# EasyEDA Pro project 9键自定义键盘.epro

# Schematic Schematic1

## Sheets
1 核心板: Board Name: Board1; Create Date: 2026-05-17; Page Name: 核心板; Project Name: 16键自定义键盘; Schematic Name: Schematic1; Update Date: 2026-05-17; Company: 逆熵科技有限公司; Drawed: BroniyaZaychik; Page Size: A4; Reviewed: BroniyaZaychik; Version: V1.0
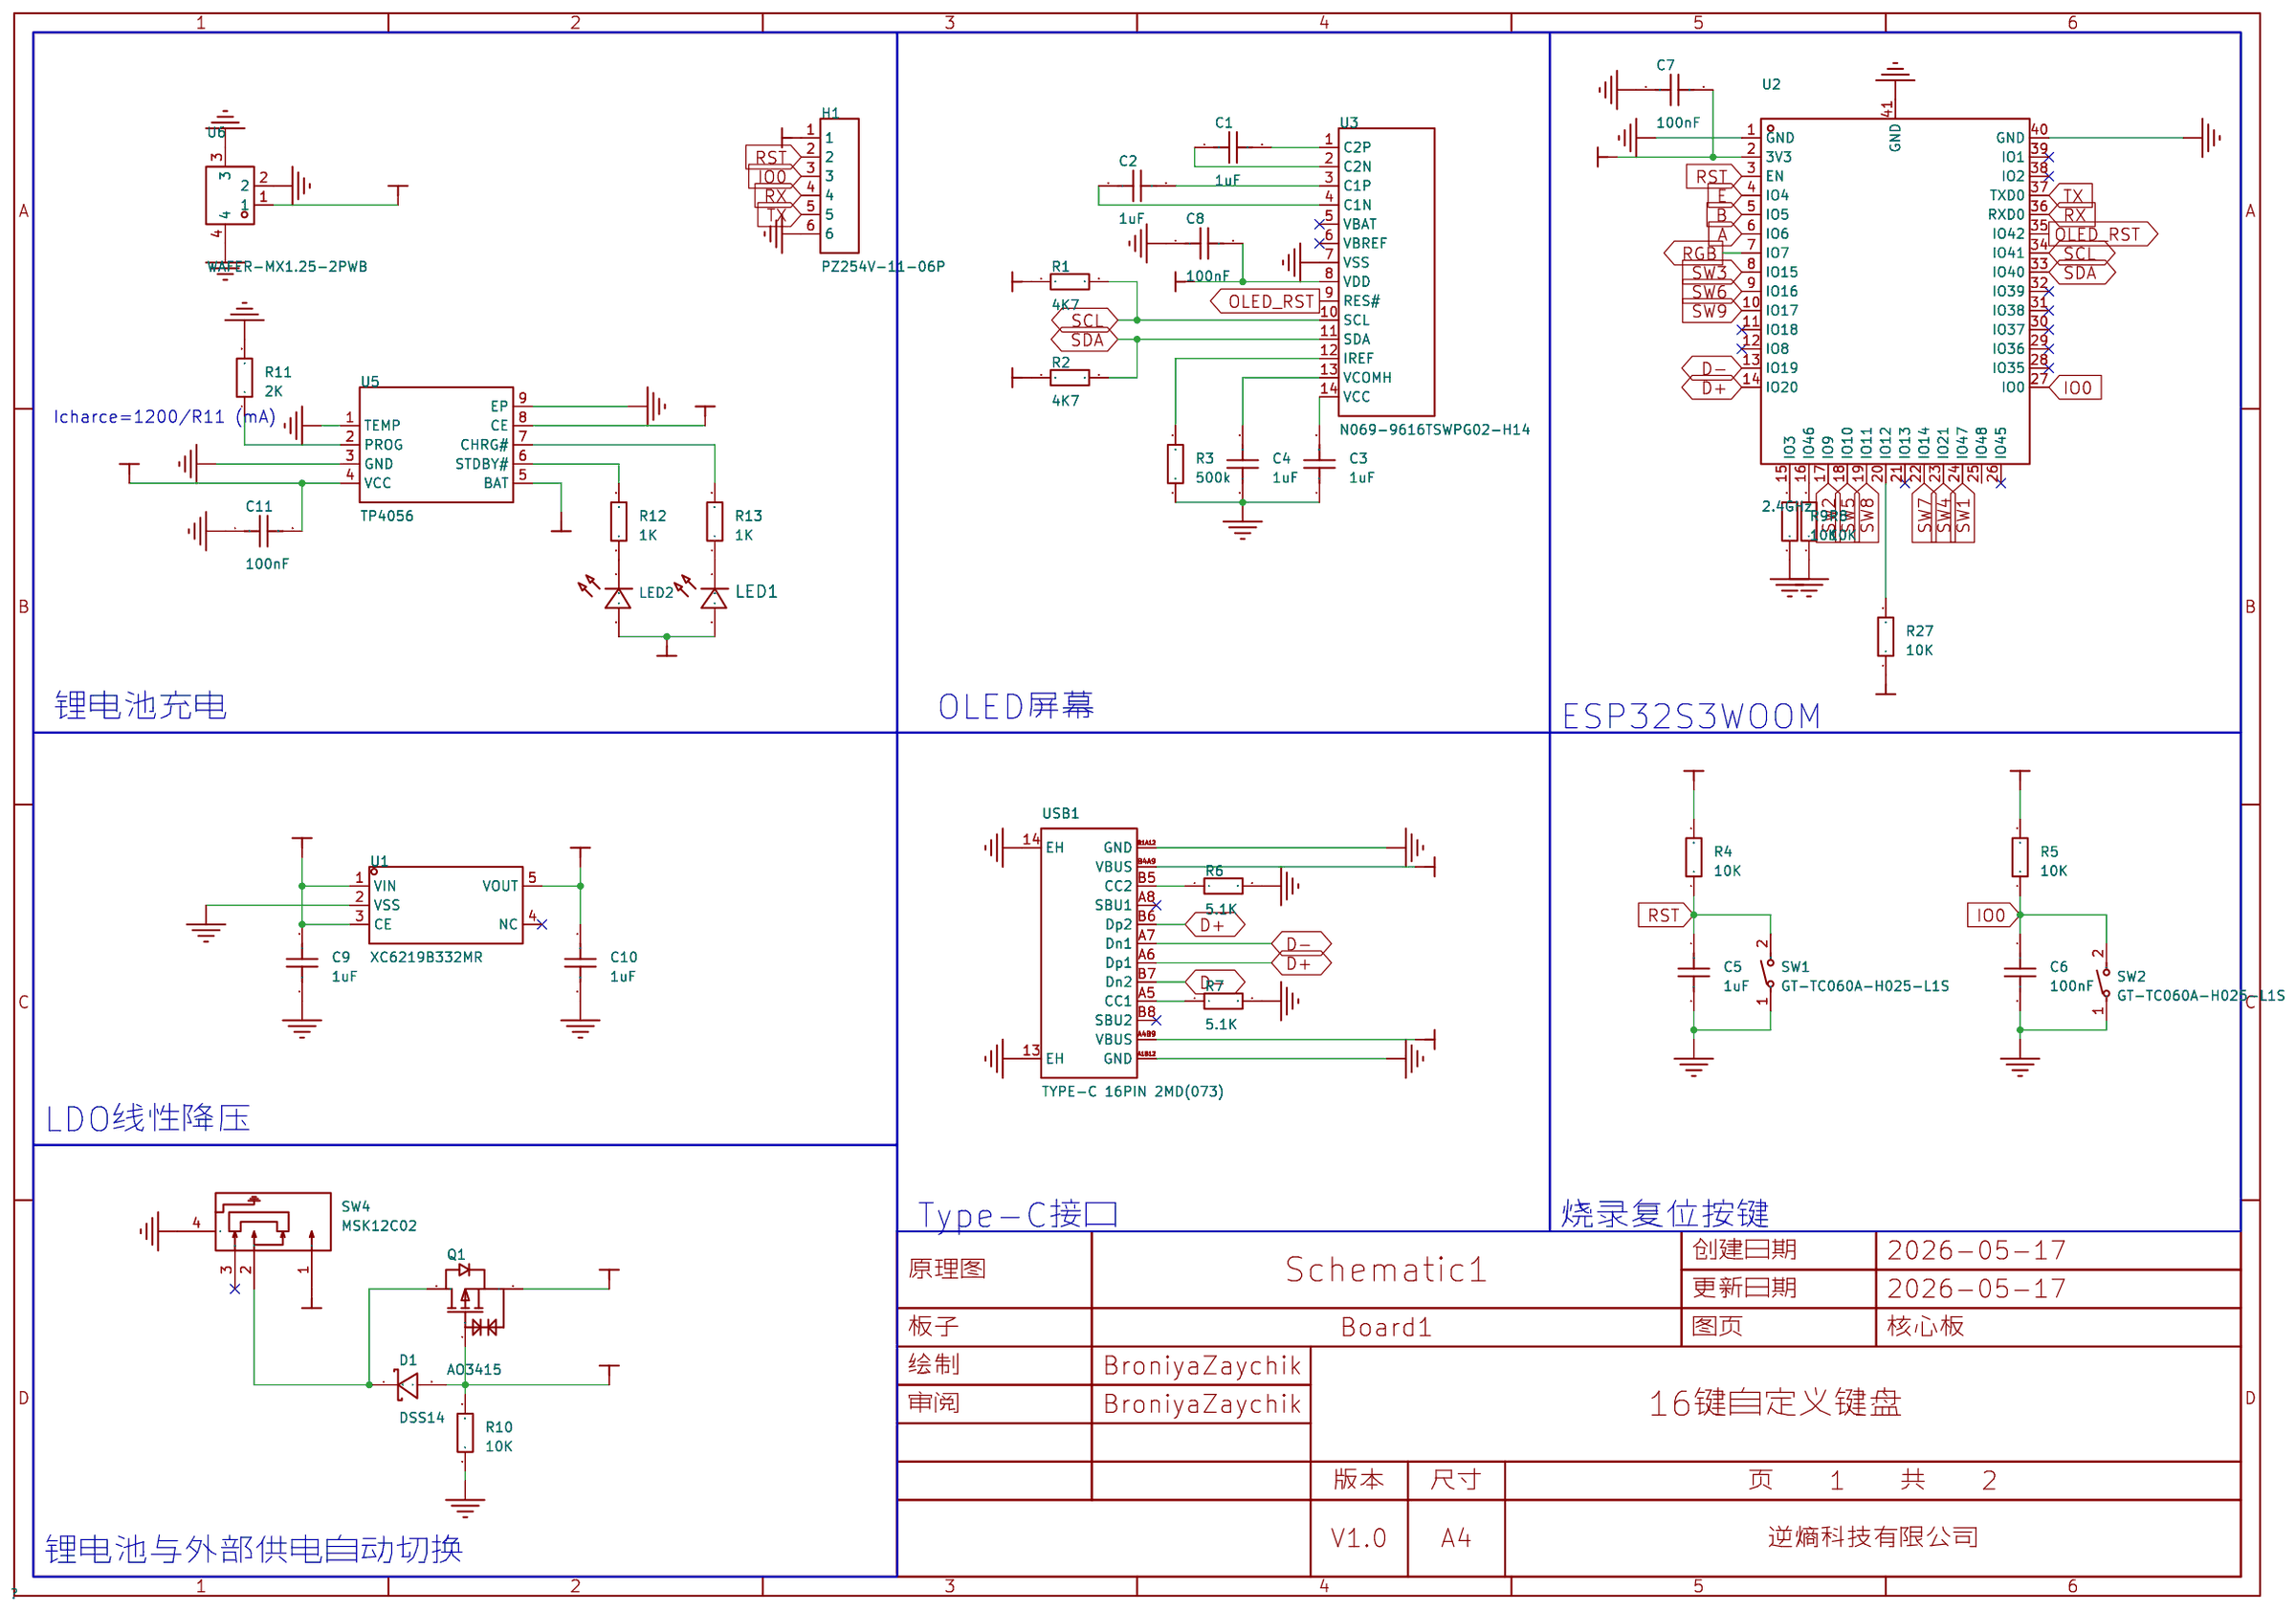
[diagram p0: 核心板]
2 按键阵列: Page Name: 按键阵列; Update Date: 2026-05-20; Company: 嘉立创EDA
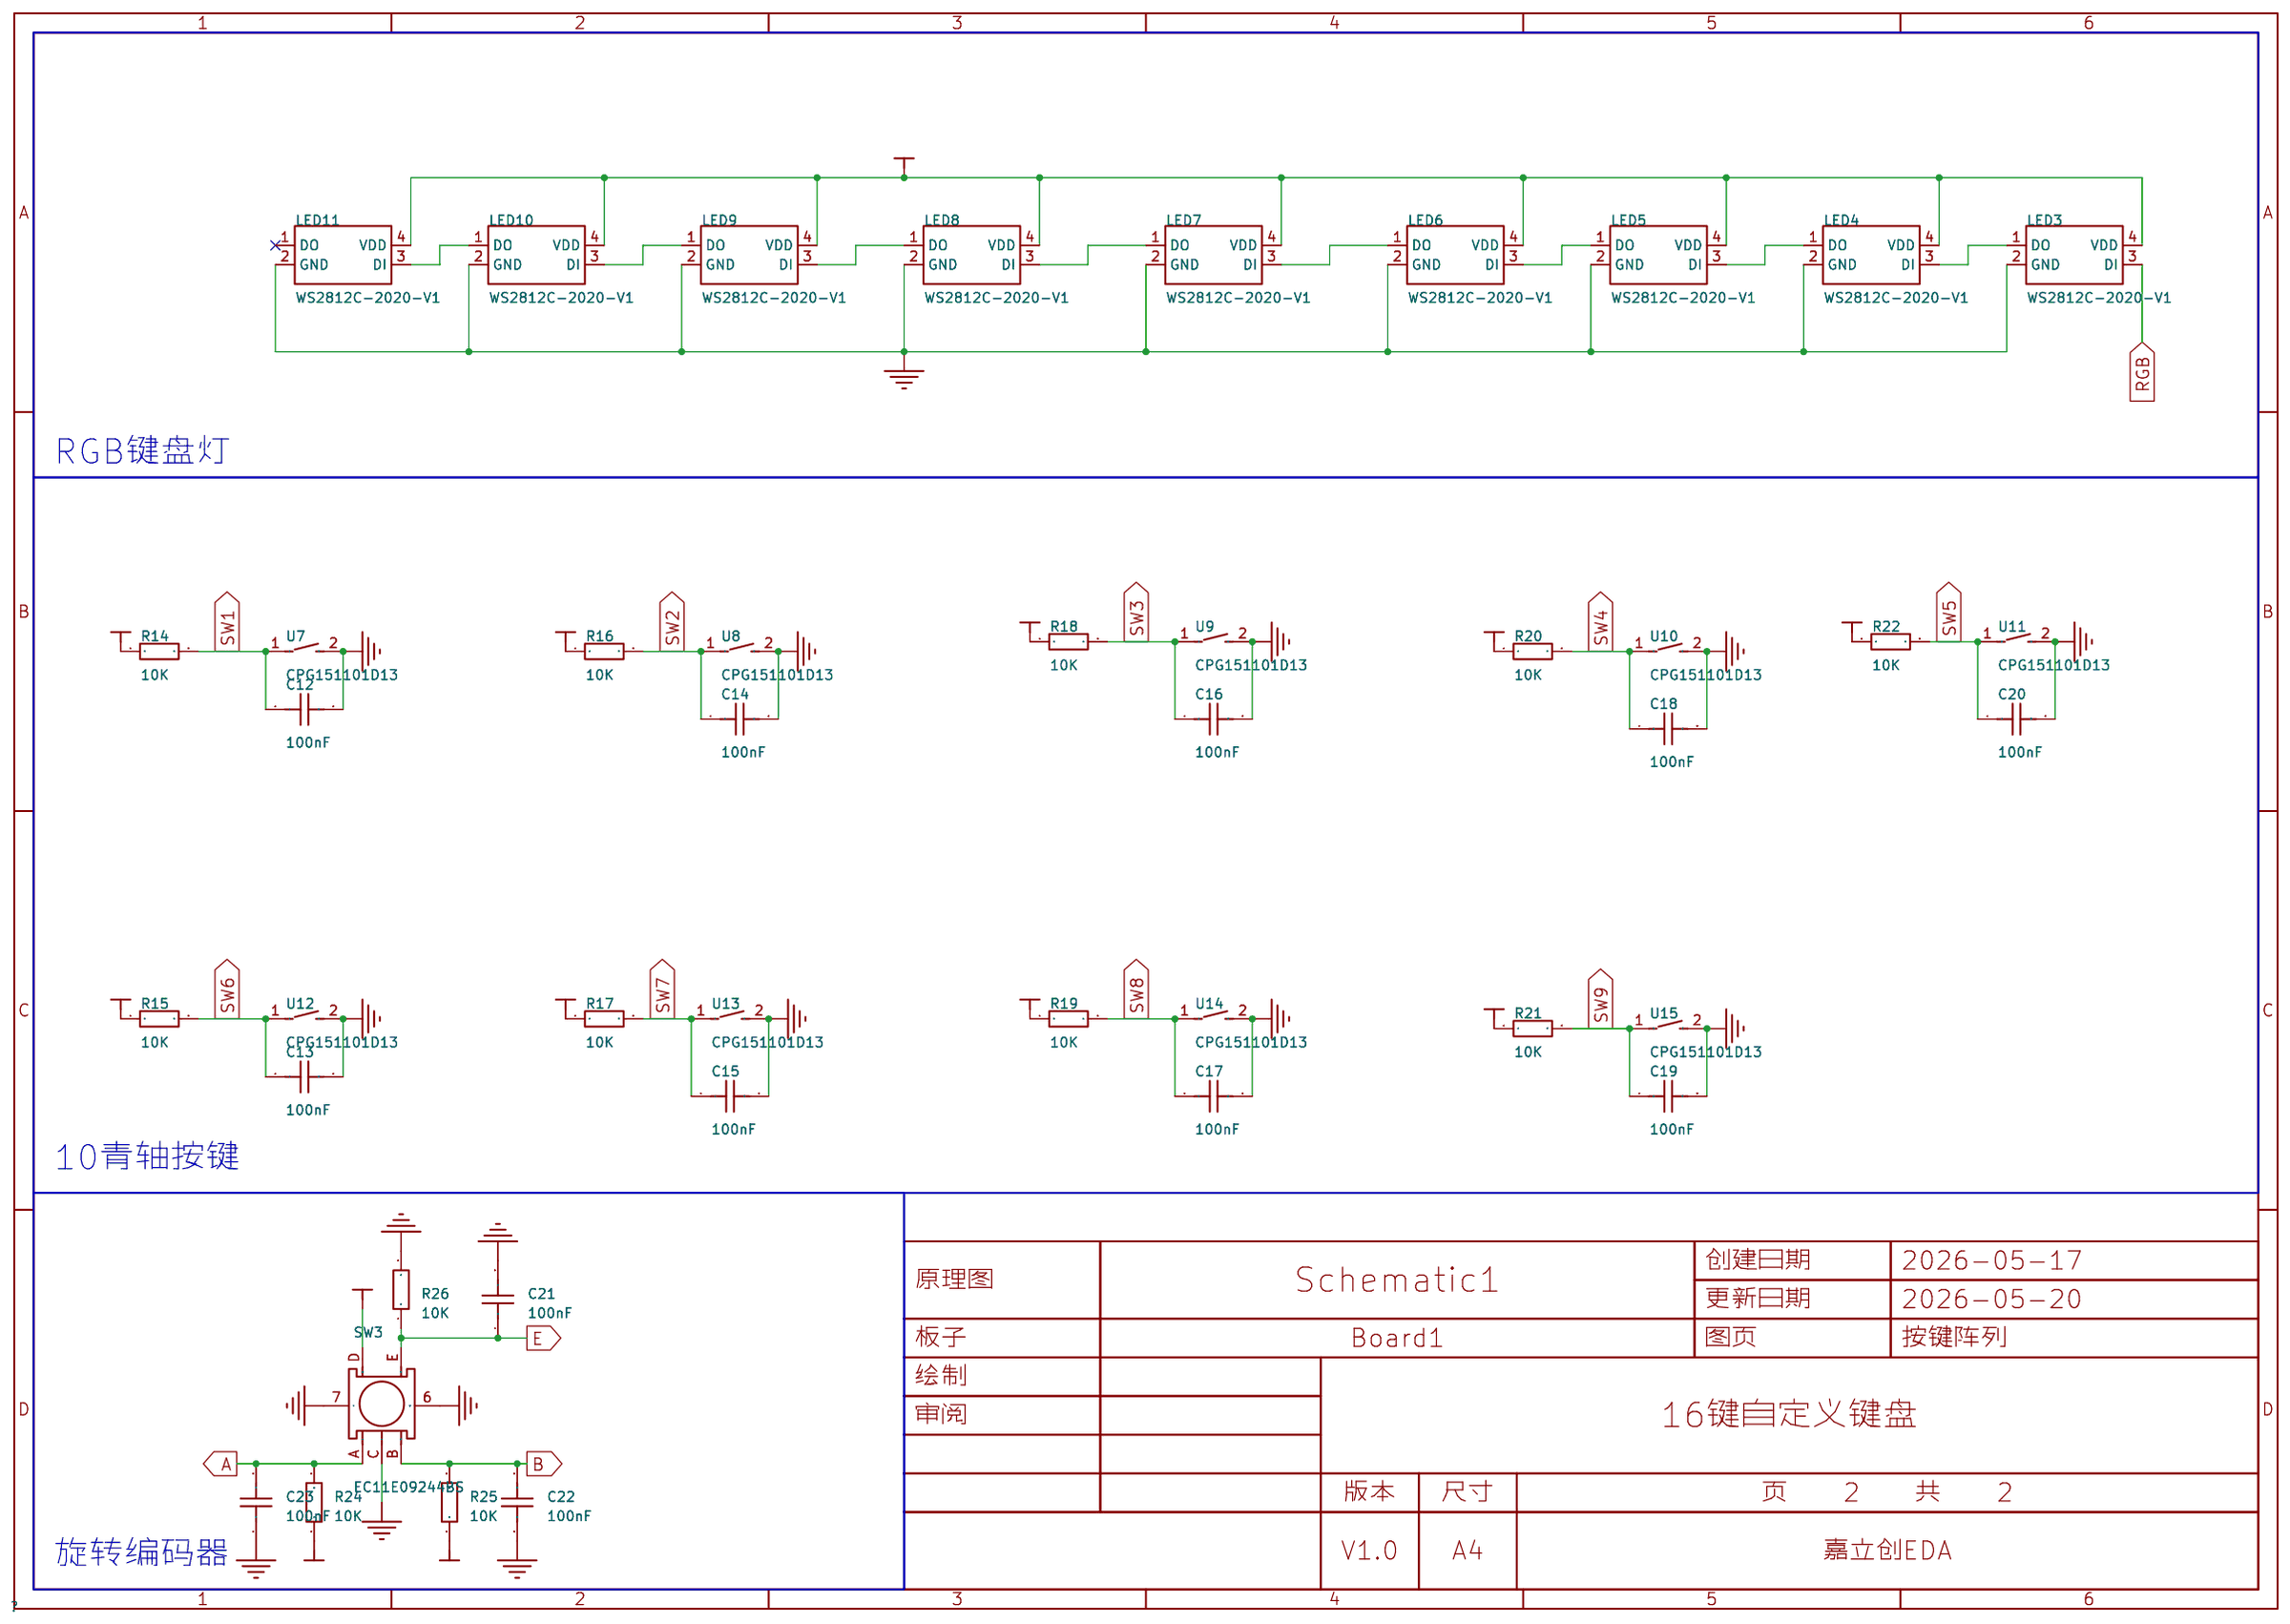
[diagram p1: 按键阵列]

## Parts
sheet 按键阵列
C12  100nF  [C0603]
C13  100nF  [C0603]
C14  100nF  [C0603]
C15  100nF  [C0603]
C16  100nF  [C0603]
C17  100nF  [C0603]
C18  100nF  [C0603]
C19  100nF  [C0603]
C20  100nF  [C0603]
C21  100nF  [C0603]
C22  100nF  [C0603]
C23  100nF  [C0603]
LED3  WS2812C-2020-V1  [LED-SMD_4P-L2.0-W2.0-TL_WS2812B-2020]
LED4  WS2812C-2020-V1  [LED-SMD_4P-L2.0-W2.0-TL_WS2812B-2020]
LED5  WS2812C-2020-V1  [LED-SMD_4P-L2.0-W2.0-TL_WS2812B-2020]
LED6  WS2812C-2020-V1  [LED-SMD_4P-L2.0-W2.0-TL_WS2812B-2020]
LED7  WS2812C-2020-V1  [LED-SMD_4P-L2.0-W2.0-TL_WS2812B-2020]
LED8  WS2812C-2020-V1  [LED-SMD_4P-L2.0-W2.0-TL_WS2812B-2020]
LED9  WS2812C-2020-V1  [LED-SMD_4P-L2.0-W2.0-TL_WS2812B-2020]
LED10  WS2812C-2020-V1  [LED-SMD_4P-L2.0-W2.0-TL_WS2812B-2020]
LED11  WS2812C-2020-V1  [LED-SMD_4P-L2.0-W2.0-TL_WS2812B-2020]
R14  10K  [R0603]
R15  10K  [R0603]
R16  10K  [R0603]
R17  10K  [R0603]
R18  10K  [R0603]
R19  10K  [R0603]
R20  10K  [R0603]
R21  10K  [R0603]
R22  10K  [R0603]
R24  10K  [R0603]
R25  10K  [R0603]
R26  10K  [R0603]
SW3  EC11E09244BS  [SW-TH_EC11XXXXXXXX]
U7  CPG151101D13  [KEY-TH_CPG151101D21X]
U8  CPG151101D13  [KEY-TH_CPG151101D21X]
U9  CPG151101D13  [KEY-TH_CPG151101D21X]
U10  CPG151101D13  [KEY-TH_CPG151101D21X]
U11  CPG151101D13  [KEY-TH_CPG151101D21X]
U12  CPG151101D13  [KEY-TH_CPG151101D21X]
U13  CPG151101D13  [KEY-TH_CPG151101D21X]
U14  CPG151101D13  [KEY-TH_CPG151101D21X]
U15  CPG151101D13  [KEY-TH_CPG151101D21X]
sheet 核心板
C1  1uF  [C0603]
C2  1uF  [C0603]
C3  1uF  [C0603]
C4  1uF  [C0603]
C5  1uF  [C0603]
C6  100nF  [C0603]
C7  100nF  [C0603]
C8  100nF  [C0603]
C9  1uF  [C0603]
C10  1uF  [C0603]
C11  100nF  [C0603]
D1  DSS14  [SOD-123FL_L2.8-W1.8-LS3.7-RD]
H1  PZ254V-11-06P  [HDR-TH_6P-P2.54-V-M]
LED1  -  [LED_0603]
LED2  -  [LED_0603]
Q1  AO3415  [SOT-23_L2.9-W1.3-P1.90-LS2.4-BR]
R1  4K7  [R0603]
R2  4K7  [R0603]
R3  500k  [R0603]
R4  10K  [R0603]
R5  10K  [R0603]
R6  5.1K  [R0603]
R7  5.1K  [R0603]
R8  10K  [R0603]
R9  10K  [R0603]
R10  10K  [R0603]
R11  2K  [R0603]
R12  1K  [R0603]
R13  1K  [R0603]
R27  10K  [R0603]
SW1  GT-TC060A-H025-L1S  [SW-SMD_L6.1-W3.5-LS8.0]
SW2  GT-TC060A-H025-L1S  [SW-SMD_L6.1-W3.5-LS8.0]
SW4  MSK12C02  [SW-TH_MSK12C02]
U1  XC6219B332MR  [SOT-23-5_L3.0-W1.7-P0.95-LS2.8-BR]
U2  2.4GHz  [WIRELM-SMD_ESP32-S3-WROOM-1]
U3  N069-9616TSWPG02-H14  [LCD-SMD_N069-9616TSWPG02-H14]
U5  TP4056  [ESOP-8_L4.9-W3.9-P1.27-LS6.0-BL-EP]
U6  WAFER-MX1.25-2PWB  [CONN-SMD_2P-P1.25_XUNPU_WAFER-MX1.25-2PWB]
USB1  TYPE-C 16PIN 2MD(073)  [USB-C-SMD_TYPE-C-16PIN-2MD-073]

## Library data of the parts
C1-C23 = CAP_0603: Supplier Footprint: 0603
LED3-LED11 = WS2812C-2020-V1: 小电流，小尺寸，适用于小尺寸，小间距产品，散热好，汽车氛围灯; LCSC Part Name: RGB三色; Supplier Part: C2976072; Manufacturer: worldsemi; Supplier Footprint: SMD,2x2mm; JLCPCB Part Class: 扩展库; Datasheet: https://atta.szlcsc.com/upload/public/pdf/source/20220222/52A01000447F5320C9A8C3F34CEFDB81.pdf; Supplier: LCSC
R1-R22 R24-R27 = Res_0603: Supplier Footprint: 0603
SW3 = EC11E09244BS: LCSC Part Name: 11型金属轴型编码器; Supplier Part: C470742; Manufacturer: ALPSALPINE(阿尔卑斯阿尔派); Supplier Footprint: 插件; JLCPCB Part Class: 扩展库; Datasheet: https://item.szlcsc.com/datasheet/EC11E09244BS/476822.html; Supplier: LCSC
U7-U15 = CPG151101D13: 轴类型:青轴;作用力:50gf;; LCSC Part Name: 青轴; Supplier Part: C49234235; Manufacturer: HanElectricity(瀚源); Supplier Footprint: 插件; JLCPCB Part Class: 扩展库; Datasheet: https://item.szlcsc.com/datasheet/CPG151101D13/51650377.html; Supplier: LCSC; Axis Type: 青轴; Operation Force: 50gf; Conduction Travel: 2.2mm; Voltage Rating: 12V; Operating Temperature: -40℃~+70℃
D1 = DSS14_C2923923: 二极管配置:独立式;正向压降(Vf):550mV@1A;直流反向耐压(Vr):40V;整流电流:1A;; LCSC Part Name: 电压:40V 电流:1A; Supplier Part: C2923923; Manufacturer: CJ(江苏长电/长晶); Supplier Footprint: SOD-123FL; JLCPCB Part Class: 扩展库; Datasheet: https://item.szlcsc.com/datasheet/DSS14/3237738.html; Supplier: LCSC; Diode Configuration: 独立式; Voltage - Forward(Vf@If): 550mV@1A; Voltage - DC Reverse(Vr): 40V; Current - Rectified: 1A; Reverse Leakage Current (Ir): 500uA@40V; Operating Junction Temperature Range: -55℃~+125℃; Non-Repetitive Peak Forward Surge Current: 30A
H1 = PZ254V-11-06P: 插针结构:1x6P;间距:2.54mm;行距:-;圆针/方针:方针;安装方式:直插;排数:单排;总PIN位数:6P;额定电流:3A;额定电压:250V;配合针长度:6mm;塑高:2.5mm;端接针长度:3mm;触头材质:黄铜;触头镀层:-;工作温度:-40℃~+105℃;颜色:黑色;; LCSC Part Name: 1x6P 间距:2.54mm 方针 直插; Supplier Part: C492405; Manufacturer: XFCN(兴飞); Supplier Footprint: 插件,P=2.54mm; JLCPCB Part Class: Extended Part; Datasheet: https://item.szlcsc.com/datasheet/PZ254V-11-06P/502961.html; Supplier: LCSC; Pin Structure: 1x6P; Pitch: 2.54mm; Circluar Pins/Square Pins: 方针; Mounting Type: 直插; Number of Rows: 单排; Number of Pins: 6P; Current Rating: 3A; Voltage Rating (Max): 250V; Length of Mating Pin: 6mm; Insulation Height: 2.5mm; Length of End Connection Pin: 3mm; Contact Material: 黄铜; Operating Temperature: -40℃~+105℃; Color: 黑色
LED1 = LED_0603-R: Supplier Footprint: 0603
LED2 = LED_0603-G: Supplier Footprint: 0603
Q1 = AO3415_C2938370: 数量:1个P沟道;漏源电压(Vdss):20V;连续漏极电流(Id):4A;导通电阻(RDS(on)):45mΩ@4.5V;耗散功率(Pd):1.2W;阈值电压(Vgs(th)):1.2V;; LCSC Part Name: 1个P沟道 耐压:20V 电流:4A; Supplier Part: C2938370; Manufacturer: GOODWORK(固得沃克); Supplier Footprint: SOT-23; JLCPCB Part Class: 扩展库; Datasheet: https://item.szlcsc.com/datasheet/AO3415/3294707.html; Supplier: LCSC; Number: 1个P沟道; Drain to Source Voltage: 20V; Current - Continuous Drain(Id): 4A; RDS(on): 45mΩ@4.5V; Pd - Power Dissipation: 1.2W; Gate Threshold Voltage (Vgs(th)): 1.2V; Gate Charge(Qg): 17.2nC@4.5V; Input Capacitance(Ciss): 1.45nF; Reverse Transfer Capacitance (Crss@Vds): 160pF; Operating Temperature: -55℃~+150℃; Type: P沟道; Output Capacitance(Coss): 205pF; Vgs: ±12V
SW1 SW2 = GT-TC060A-H025-L1S: 电路结构:单刀单掷;作用力:1.6N;安装方式:立贴;带支架:不带;触点电流:50mA;额定电压(AC):12V;额定电压(DC):12V;绝缘电阻:100MΩ;带灯:无;机械寿命:10万次;; LCSC Part Name: 3×6×2.5 立贴 无声轻触开关; Supplier Part: C7450623; Manufacturer: G-Switch(品赞); Supplier Footprint: SMD,3x6mm; JLCPCB Part Class: Extended Part; Datasheet: https://atta.szlcsc.com/upload/public/pdf/source/20230712/3FF422A4BEDB42853830040444FDF292.pdf; Supplier: LCSC; Circuit: 单刀单掷; Operating Force: 1.6N; Mounting Style: 立贴; Strike Gundam: 不带; Contact Current: 50mA; Voltage Rating (AC): 12V; Voltage Rating (DC): 12V; Insulation Resistance: 100MΩ; With Lamp: 无; Mechanical Life: 10万次
SW4 = MSK12C02: 电路结构:单刀双掷;安装方式:卧贴;开关颜色:-;额定电流:50mA;额定电压:12V;工作寿命:1万次;; LCSC Part Name: MSK12C02 白柄1.5编带; Supplier Part: C431540; Manufacturer: SHOU HAN(首韩); Supplier Footprint: SMD,8x2.8mm; JLCPCB Part Class: Extended Part; Datasheet: https://item.szlcsc.com/datasheet/MSK12C02/427897.html; Supplier: LCSC; Circuit: 单刀双掷; Termination Style: SMD接片; Length: 8mm; Width: 2.8mm; Switch Height: 1.4mm; Mounting Type: 卧贴; Current Rating: 50mA; Voltage Rating: 12V; Life: 1万次; Operating Temperature: -20℃~+70℃
U1 = XC6219B332MR_C347386: 输出极性:正极;工作电压:7V;输出电压:3.3V;输出电流:300mA;电源纹波抑制比(PSRR):40dB@(1kHz);输出类型:固定;; LCSC Part Name: 3.3V 300mA 7V; Supplier Part: C347386; Manufacturer: UMW(友台半导体); Supplier Footprint: SOT-23-5; JLCPCB Part Class: Extended Part; Datasheet: https://item.szlcsc.com/datasheet/XC6219B332MR/324046.html; Supplier: LCSC; Output Configuration: 正极; Voltage - Supply: 7V; Output Voltage: 3.3V; Output Current: 300mA; Power Supply Rejection Ratio (PSRR): 40dB@(1kHz); Voltage Dropout: 280mV@(100mA); standby current: 15uA; Features: 过流保护；使能控制；短路保护; Operating Temperature: -20℃~+60℃; Output Type: 固定; Number of Outputs: 1
U2 = ESP32-S3-WROOM-1-N8R8: 核心芯片:ESP32-S3R8;频率:2.4GHz;天线形式:板载PCB天线;发射功率:20.5dBm;接收灵敏度:-104.5dBm;; LCSC Part Name: 不带固件 2.4GHz Wi-Fi (802.11b/g/n) + 蓝牙 5 (LE) 模组; Supplier Part: C2913201; Manufacturer: ESPRESSIF(乐鑫); Supplier Footprint: SMD,25.5x18mm; JLCPCB Part Class: 扩展库; Datasheet: https://item.szlcsc.com/datasheet/ESP32-S3-WROOM-1-N8R8/3198299.html; Supplier: LCSC; Utilized IC / Part: ESP32-S3R8; Wireless Standard: Bluetooth5.0; Interface Type: I2C；GPIO；UART；SPI；USB；I2S; Antenna Type: 板载PCB天线; Output Power: 20.5dBm; Voltage - Supply: 3V~3.6V; Receive  Current: 97mA; Send  Current: 330mA; Sensitivity: -104.5dBm; Operating Temperature: -40℃~+65℃
U3 = N069-9616TSWPG02-H14: 核心芯片:SSD1315;尺寸(inch):0.69;像素分辨率:96x16;; LCSC Part Name: 0.69寸 白光 96x16像素分辨率 14PIN; Supplier Part: C5123561; Manufacturer: Wisevision(新智景); JLCPCB Part Class: 扩展库; Datasheet: https://item.szlcsc.com/datasheet/N069-9616TSWPG02-H14/5717754.html; Supplier: LCSC; Controller Type: SSD1315; Size: 0.69; Dot Pixels: 96x16
U5 = TP4056_C725790: 工作电压:4V~6.5V;最大充电电流:1A;电池类型:锂电池;电池节数:1;; LCSC Part Name: 1A独立式线性锂离子电池充电器; Supplier Part: C725790; Manufacturer: UMW(友台半导体); Supplier Footprint: ESOP-8; JLCPCB Part Class: 扩展库; Datasheet: https://item.szlcsc.com/datasheet/TP4056/772193.html; Supplier: LCSC; The Chip Type: 充电芯片; Voltage - Supply: 4V~6.5V; Charge Current - Max: 1A; Charging Saturation Voltage: 4.2V; Type of Battery: 锂电池; Number of Cells: 1; Operating Temperature: -40℃~+85℃; Battery Temperature Detection: 支持; 0V Battery Charge: 支持; Supply Current (Iq): 35uA; Features: 恒压充电；恒流充电；自动再充电；充电终止；软启动；可编程充电电流；欠压锁定；涓流充电
U6 = WAFER-MX1.25-2PWB: 插针结构:1x2P;间距:1.25mm;安装方式:卧贴;参考系列:PicoBlade(MX 1.25);总PIN数:2P;排数:1;每排PIN数:2;行距:-;额定电流:1A;触头材质:黄铜;触头镀层:锡;工作温度:-25℃~+85℃;; LCSC Part Name: 1x2P 间距:1.25mm 卧贴 系列:PicoBlade(MX 1.25); Supplier Part: C3029359; Manufacturer: XUNPU(讯普); Supplier Footprint: SMD,P=1.25mm,卧贴; JLCPCB Part Class: 扩展库; Datasheet: https://item.szlcsc.com/datasheet/WAFER-MX1.25-2PWB/3561371.html; Supplier: LCSC; Pins Structure: 1x2P; Pitch: 1.25mm; Mounting Type: 卧贴; Reference Series: PicoBlade(MX 1.25); Number of Pins: 2P; Number of Rows: 1; Number of PINs Per Row: 2; Current Rating: 1A; Contact Material: 黄铜; Contact Plating: 锡; Operating Temperature: -25℃~+85℃; Voltage Rating: 125V; Plastic Material: LCP; Supplementary Features: 辅助焊脚; Color: 米色; Z-Height of the Board: 3.6mm; X-Length of Bottom Edge on Board (Spacing Line): 7.5mm; Y-Width of Bottom Edge on Board: 5.25mm
USB1 = TYPE-C 16PIN 2MD(073): 连接器类型:Type-C;协议标准:-;公母:母;安装方式:卧贴;触点数量:16P;端口数量:1;额定电流 - 电源:3A;工作温度:-25℃~+85℃;; LCSC Part Name: Type-C 母 卧贴; Supplier Part: C2765186; Manufacturer: SHOU HAN(首韩); Supplier Footprint: SMD; JLCPCB Part Class: 扩展库; Datasheet: https://item.szlcsc.com/datasheet/TYPE-C%252016PIN%25202MD(073)/2901843.html; Supplier: LCSC; Connector Type: Type-C; Gender: 母; Mounting Type: 卧贴; Number of Contacts: 16P; Number of Ports: 1; Current Rating-Power: 3A; Voltage Rating: 5V; Connect-Disconnect Life: 1万次; Detection color: 黑色; Operating Temperature: -25℃~+85℃

## Nets
3V3: C7.2 C8.2 C10.1 H1.1 R1.1 R2.1 R4.2 R5.2 R14.1 R15.1 R16.1 R17.1 R18.1 R19.1 R20.1 R21.1 R22.1 R24.1 R25.1 SW3.D U1.5(VOUT) U2.2(3V3) U3.8(VDD)
+5V: C11.2 D1.2(A) LED1.2(A) LED2.2(A) Q1.1(G) R10.2 R27.1 U5.4(VCC) U5.8(CE) USB1.A4B9(VBUS) USB1.B4A9(VBUS)
GND: C3.1 C4.1 C5.2 C6.2 C7.1 C8.1 C9.1 C10.2 C11.1 C12.2 C13.2 C14.2 C15.2 C16.2 C17.2 C18.2 C19.2 C20.2 C21.2 C22.1 C23.1 H1.6 LED3.2(GND) LED4.2(GND) LED5.2(GND) LED6.2(GND) LED7.2(GND) LED8.2(GND) LED9.2(GND) LED10.2(GND) LED11.2(GND) R3.1 R6.2 R7.2 R8.1 R9.1 R10.1 R11.2 R26.2 SW1.1 SW2.1 SW3.6 SW3.7 SW3.C SW4.4 U1.2(VSS) U2.1(GND) U2.40(GND) U2.41(GND) U3.7(VSS) U5.1(TEMP) U5.3(GND) U5.9(EP) U6.2 U6.3 U6.4 U7.2 U8.2 U9.2 U10.2 U11.2 U12.2 U13.2 U14.2 U15.2 USB1.13(EH) USB1.14(EH) USB1.A1B12(GND) USB1.B1A12(GND)
VBAT: Q1.2(S) U5.5(BAT) U6.1
VCC: C9.2 LED3.4(VDD) LED4.4(VDD) LED5.4(VDD) LED6.4(VDD) LED7.4(VDD) LED8.4(VDD) LED9.4(VDD) LED10.4(VDD) LED11.4(VDD) SW4.1 U1.1(VIN) U1.3(CE)
A: C23.2 R24.2 SW3.A U2.6(IO6)
B: C22.2 R25.2 SW3.B U2.5(IO5)
D+: U2.14(IO20) USB1.A6(Dp1) USB1.B6(Dp2)
D-: U2.13(IO19) USB1.A7(Dn1) USB1.B7(Dn2)
E: C21.1 R26.1 SW3.E U2.4(IO4)
IO0: C6.1 H1.3 R5.1 SW2.2 U2.27(IO0)
OLED_RST: U2.35(IO42) U3.9(RES#)
RGB: LED3.3(DI) U2.7(IO7)
RST: C5.1 H1.2 R4.1 SW1.2 U2.3(EN)
RX: H1.4 U2.36(RXD0)
SCL: R1.2 U2.34(IO41) U3.10(SCL)
SDA: R2.2 U2.33(IO40) U3.11(SDA)
SW1: C12.1 R14.2 U2.24(IO47) U7.1
SW2: C14.1 R16.2 U2.17(IO9) U8.1
SW3: C16.1 R18.2 U2.8(IO15) U9.1
SW4: C18.1 R20.2 U2.23(IO21) U10.1
SW5: C20.1 R22.2 U2.18(IO10) U11.1
SW6: C13.1 R15.2 U2.9(IO16) U12.1
SW7: C15.1 R17.2 U2.22(IO14) U13.1
SW8: C17.1 R19.2 U2.19(IO11) U14.1
SW9: C19.1 R21.2 U2.10(IO17) U15.1
TX: H1.5 U2.37(TXD0)
$1N2133: C1.2 U3.1(C2P)
$1N2137: C1.1 U3.2(C2N)
$1N2143: C2.2 U3.3(C1P)
$1N2148: C2.1 U3.4(C1N)
$1N2568: R3.2 U3.12(IREF)
$1N2573: C4.2 U3.13(VCOMH)
$1N2579: C3.2 U3.14(VCC)
$1N3771: R6.1 USB1.B5(CC2)
$1N3797: R7.1 USB1.A5(CC1)
$1N5918: R11.1 U5.2(PROG)
$1N6180: LED2.1(C) R12.1
$1N6206: LED1.1(C) R13.1
$1N6234: R12.2 U5.6(STDBY#)
$1N6239: R13.2 U5.7(CHRG#)
$1N7983: R27.2 U2.20(IO12)
$1N8046: D1.1(C) Q1.3(D) SW4.2
$1N8051: R9.2 U2.15(IO3)
$1N8053: R8.2 U2.16(IO46)
$2N1506: LED3.1(DO) LED4.3(DI)
$2N1512: LED4.1(DO) LED5.3(DI)
$2N1519: LED5.1(DO) LED6.3(DI)
$2N1526: LED6.1(DO) LED7.3(DI)
$2N1533: LED7.1(DO) LED8.3(DI)
$2N1540: LED8.1(DO) LED9.3(DI)
$2N1547: LED9.1(DO) LED10.3(DI)
$2N1562: LED10.1(DO) LED11.3(DI)

Not connected (* = marked no-connect by the designer): LED11 1(DO)*; SW4 3*; U1 4(NC)*; U2 11(IO18)* 12(IO8)* 21(IO13)* 25(IO48) 26(IO45)* 28(IO35)* 29(IO36)* 30(IO37)* 31(IO38)* 32(IO39)* 38(IO2)* 39(IO1)*; U3 5(VBAT)* 6(VBREF)*; USB1 A8(SBU1)* B8(SBU2)*

## Notes on the sheets
sheet 1
- Icharce=1200/R11 (mA)
- 锂电池充电
- OLED屏幕
- ESP32S3WOOM
- LDO线性降压
- Type-C接口
- 烧录复位按键
- 锂电池与外部供电自动切换
sheet 2
- RGB键盘灯
- 10青轴按键
- 旋转编码器

# Board PCB1
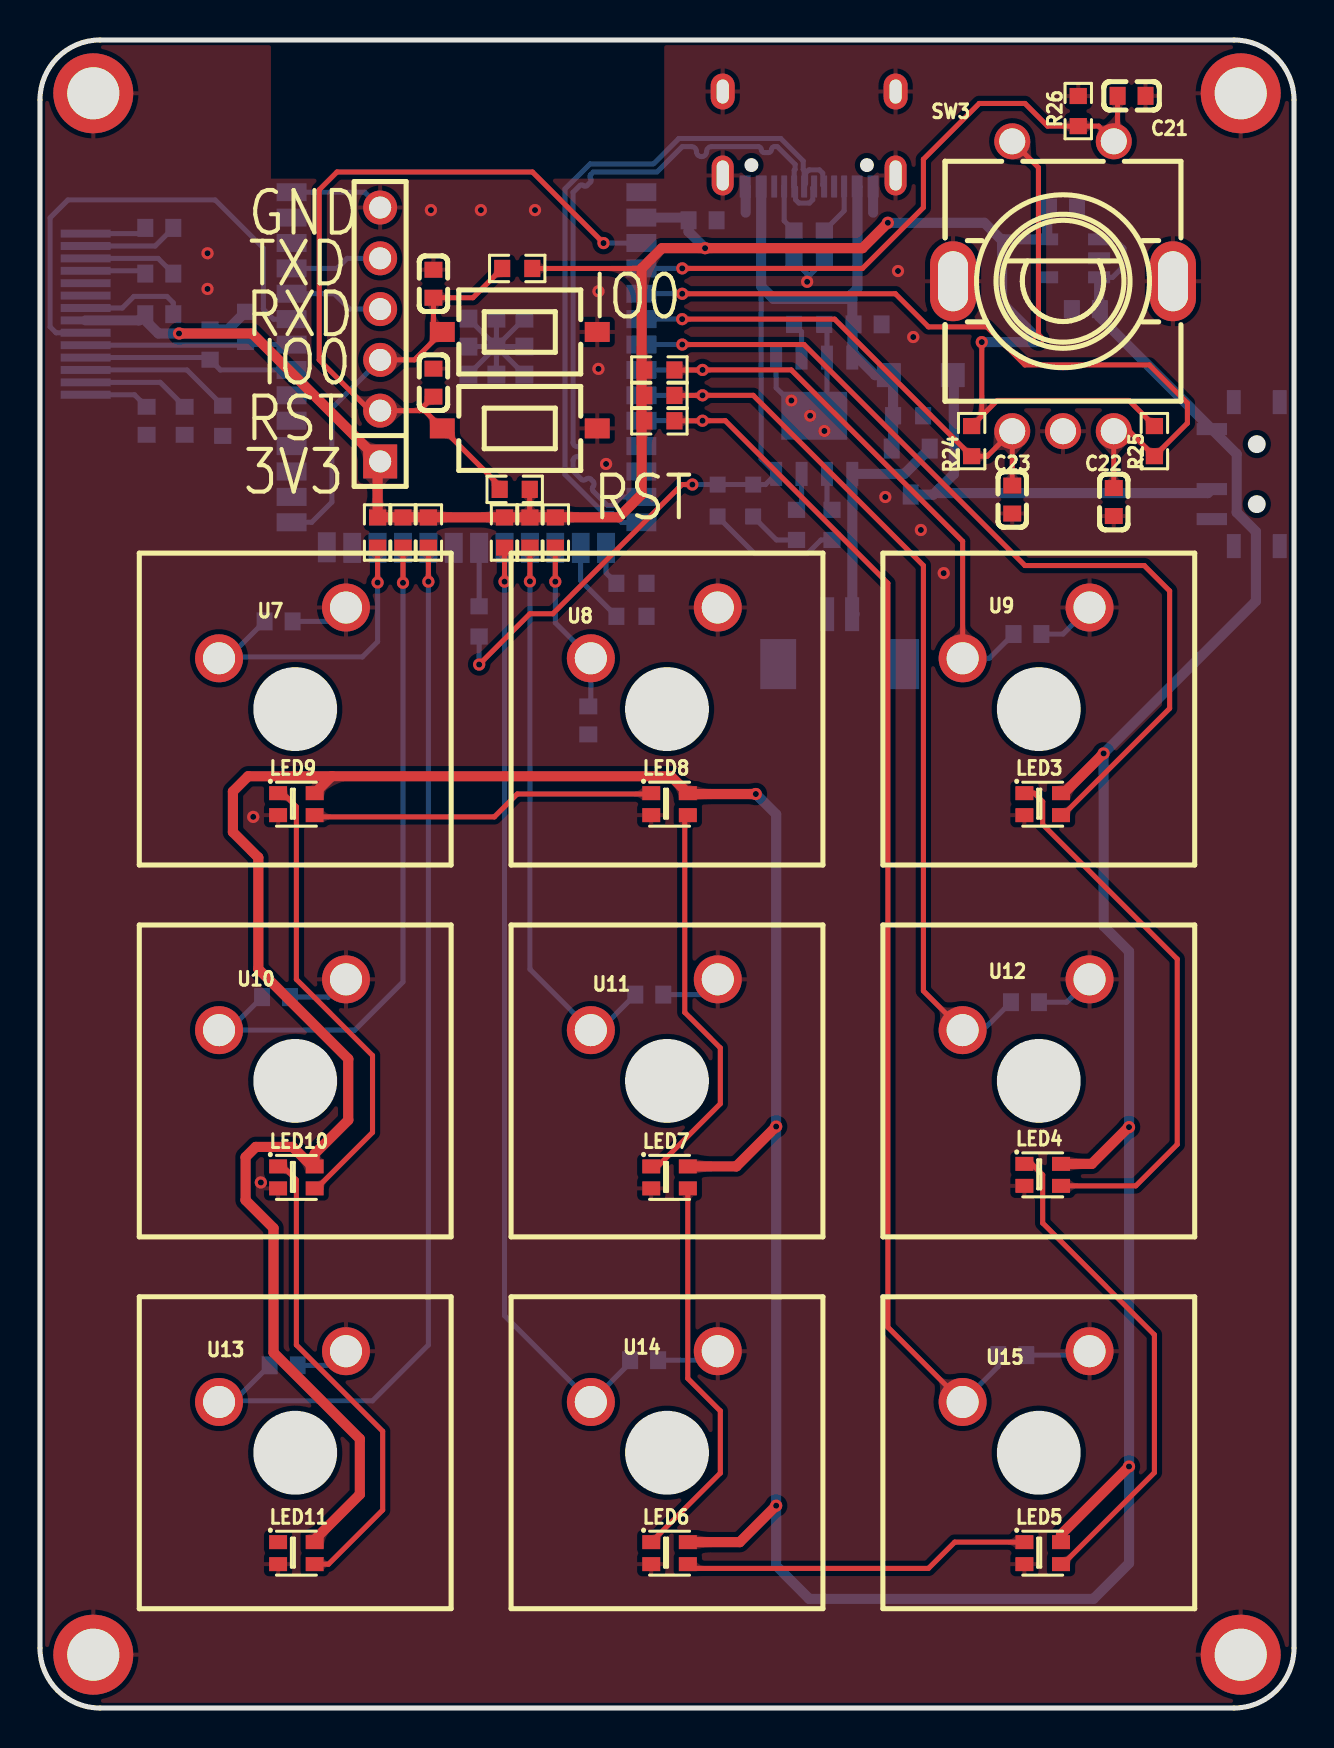
[diagram p2: board, top side]
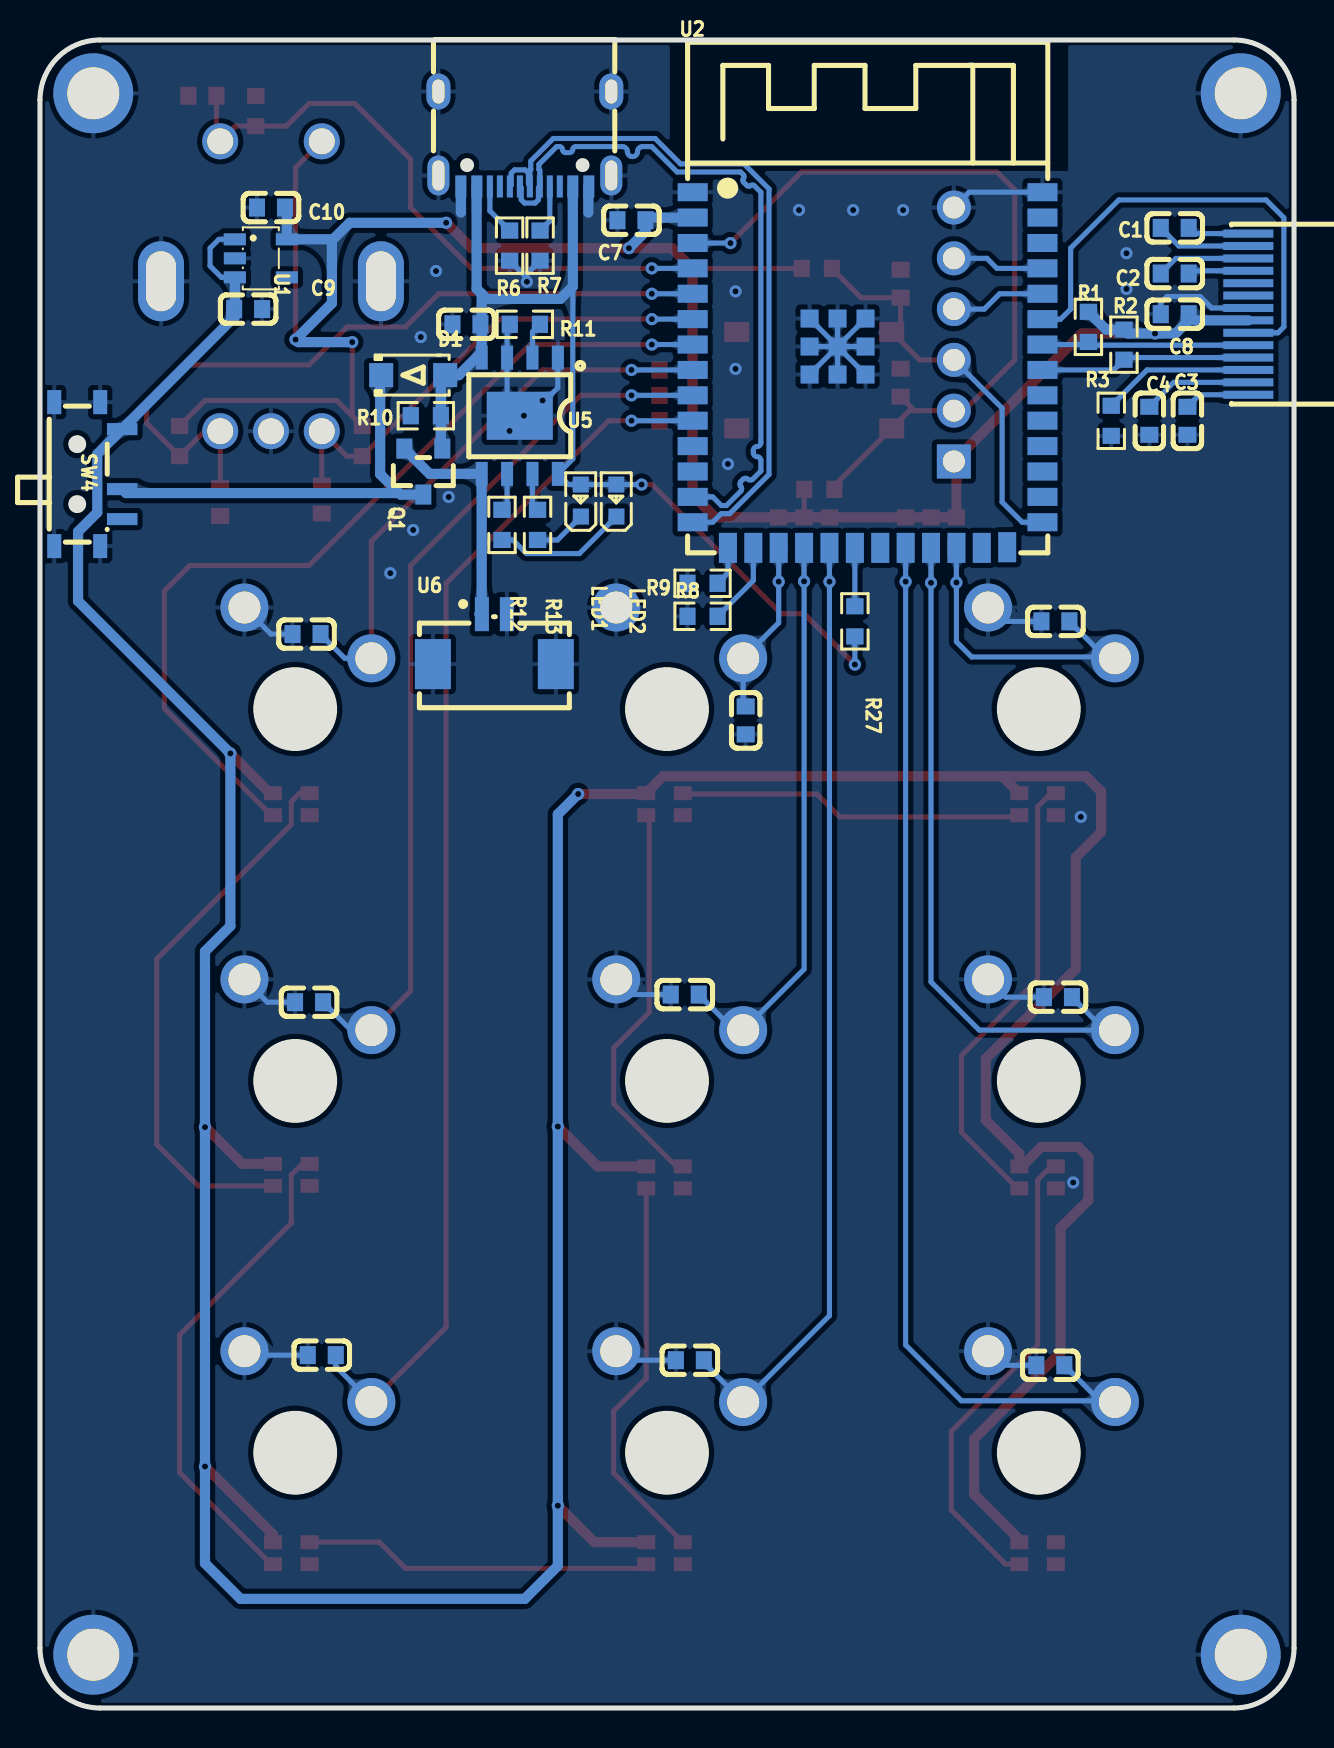
[diagram p3: board, bottom side, seen from below]

Outline 62.74 x 83.44 mm; copper layers: Top Layer, Bottom Layer. Coordinates in mm from the lower left corner of the outline.
Outline path: 0,80.44 0,3 arc(0.88,0.88) 3,0 59.74,0 arc(61.86,0.88) 62.74,3 62.74,80.44 arc(61.86,82.56) 59.74,83.44 3,83.44 arc(0.88,82.56) 0,80.44
Stack: Top Layer 0.035mm / Dielectric1 1.51mm FR4 er 4.5 / Bottom Layer 0.035mm

## Design rules (mm)
net D-: DP1
net D+: DP1
spacing copperThickness1oz (default): track to track 0.102, other pairs 0.152 to 0.3
spacing copperThickness2oz: track to track 0.203, other pairs 0.152 to 0.3
track width copperThickness1oz (default): min 0.127, default 0.254, max 2.54
track width copperThickness2oz: min 0.203, default 0.254, max 2.54
differential pair differentialPair (default): width min 0.127, default 0.254, max 2.54; gap min 0.152, default 0.152
net GND uses copperRegion

## Placement (name value [footprint] x y rotation side)
C1  1uF  [C0603]  5.97 74.04 180 bottom
C2  1uF  [C0603]  5.97 71.75 0 bottom
C3  1uF  [C0603]  5.33 64.39 90 bottom
C4  1uF  [C0603]  7.24 64.39 90 bottom
C5  1uF  [C0603]  19.68 66.3 90 top
C6  100nF  [C0603]  19.68 71.25 90 top
C7  100nF  [C0603]  33.15 74.42 180 bottom
C8  100nF  [C0603]  5.97 69.72 180 bottom
C9  1uF  [C0603]  52.32 69.98 0 bottom
C10  1uF  [C0603]  51.18 75.06 0 bottom
C11  100nF  [C0603]  41.4 69.22 180 bottom
C12  100nF  [C0603]  11.94 54.36 0 bottom
C13  100nF  [C0603]  49.28 35.31 0 bottom
C14  100nF  [C0603]  27.43 49.4 270 bottom
C15  100nF  [C0603]  12.19 17.15 0 bottom
C16  100nF  [C0603]  49.4 53.72 0 bottom
C17  100nF  [C0603]  30.23 17.4 0 bottom
C18  100nF  [C0603]  11.81 35.56 0 bottom
C19  100nF  [C0603]  48.64 17.65 0 bottom
C20  100nF  [C0603]  30.48 35.69 0 bottom
C21  100nF  [C0603]  54.61 80.64 0 top
C22  100nF  [C0603]  53.72 60.33 90 top
C23  100nF  [C0603]  48.64 60.45 90 top
D1  DSS14  [SOD-123FL_L2.8-W1.8-LS3.7-RD]  44.07 66.67 180 bottom
H1  PZ254V-11-06P  [HDR-TH_6P-P2.54-V-M]  17.02 68.71 90 top
LED1  -  [LED_0603]  35.69 60.45 90 bottom
LED2  -  [LED_0603]  33.91 60.45 90 bottom
LED3  WS2812C-2020-V1  [LED-SMD_4P-L2.0-W2.0-TL_WS2812B-2020]  50.17 45.21 0 top
LED4  WS2812C-2020-V1  [LED-SMD_4P-L2.0-W2.0-TL_WS2812B-2020]  50.17 26.67 0 top
LED5  WS2812C-2020-V1  [LED-SMD_4P-L2.0-W2.0-TL_WS2812B-2020]  50.17 7.75 0 top
LED6  WS2812C-2020-V1  [LED-SMD_4P-L2.0-W2.0-TL_WS2812B-2020]  31.5 7.75 0 top
LED7  WS2812C-2020-V1  [LED-SMD_4P-L2.0-W2.0-TL_WS2812B-2020]  31.5 26.54 0 top
LED8  WS2812C-2020-V1  [LED-SMD_4P-L2.0-W2.0-TL_WS2812B-2020]  31.5 45.21 0 top
LED9  WS2812C-2020-V1  [LED-SMD_4P-L2.0-W2.0-TL_WS2812B-2020]  12.83 45.21 0 top
LED10  WS2812C-2020-V1  [LED-SMD_4P-L2.0-W2.0-TL_WS2812B-2020]  12.83 26.54 0 top
LED11  WS2812C-2020-V1  [LED-SMD_4P-L2.0-W2.0-TL_WS2812B-2020]  12.83 7.75 0 top
NOREF  -  [Pad_e316]  2.67 80.77 0 top
NOREF#2  -  [Pad_e314]  60.07 2.67 0 top
NOREF#3  -  [Pad_e313]  60.07 80.77 0 top
NOREF#4  -  [Pad_e315]  2.67 2.67 0 top
Q1  AO3415  [SOT-23_L2.9-W1.3-P1.90-LS2.4-BR]  43.56 61.85 90 bottom
R1  4K7  [R0603]  10.29 69.09 270 bottom
R2  4K7  [R0603]  8.51 68.2 270 bottom
R3  500k  [R0603]  9.14 64.39 90 bottom
R4  10K  [R0603]  23.75 60.96 0 top
R5  10K  [R0603]  23.88 72.01 0 top
R6  5.1K  [R0603]  39.24 73.15 270 bottom
R7  5.1K  [R0603]  37.72 73.15 270 bottom
R8  10K  [R0603]  29.59 54.61 180 bottom
R9  10K  [R0603]  29.59 56.26 180 bottom
R10  10K  [R0603]  43.43 64.64 180 bottom
R11  2K  [R0603]  38.48 69.22 0 bottom
R12  1K  [R0603]  39.62 59.18 90 bottom
R13  1K  [R0603]  37.85 59.18 90 bottom
R14  10K  [R0603]  16.89 58.8 270 top
R15  10K  [R0603]  30.99 65.66 0 top
R16  10K  [R0603]  25.78 58.8 270 top
R17  10K  [R0603]  19.43 58.8 270 top
R18  10K  [R0603]  30.99 66.93 0 top
R19  10K  [R0603]  23.24 58.8 270 top
R20  10K  [R0603]  18.16 58.8 270 top
R21  10K  [R0603]  30.99 64.39 0 top
R22  10K  [R0603]  24.51 58.8 270 top
R24  10K  [R0603]  46.61 63.37 270 top
R25  10K  [R0603]  55.75 63.37 270 top
R26  10K  [R0603]  51.94 79.88 90 top
R27  10K  [R0603]  21.97 54.36 90 bottom
SW1  GT-TC060A-H025-L1S  [SW-SMD_L6.1-W3.5-LS8.0]  24 64.01 180 top
SW2  GT-TC060A-H025-L1S  [SW-SMD_L6.1-W3.5-LS8.0]  24 68.83 180 top
SW3  EC11E09244BS  [SW-TH_EC11XXXXXXXX]  51.18 71.12 0 top
SW4  MSK12C02  [SW-TH_MSK12C02]  60.33 61.72 270 bottom
U1  XC6219B332MR  [SOT-23-5_L3.0-W1.7-P0.95-LS2.8-BR]  51.69 72.52 0 bottom
U2  2.4GHz  [WIRELM-SMD_ESP32-S3-WROOM-1]  21.34 66.93 180 bottom
U3  N069-9616TSWPG02-H14  [LCD-SMD_N069-9616TSWPG02-H14]  2.29 69.72 0 bottom
U5  TP4056  [ESOP-8_L4.9-W3.9-P1.27-LS6.0-BL-EP]  38.73 64.64 0 bottom
U6  WAFER-MX1.25-2PWB  [CONN-SMD_2P-P1.25_XUNPU_WAFER-MX1.25-2PWB]  40 53.47 180 bottom
U7  CPG151101D13  [KEY-TH_CPG151101D21X]  12.13 53.78 0 top
U8  CPG151101D13  [KEY-TH_CPG151101D21X]  30.73 53.78 0 top
U9  CPG151101D13  [KEY-TH_CPG151101D21X]  49.33 53.78 0 top
U10  CPG151101D13  [KEY-TH_CPG151101D21X]  12.13 35.18 0 top
U11  CPG151101D13  [KEY-TH_CPG151101D21X]  30.73 35.18 0 top
U12  CPG151101D13  [KEY-TH_CPG151101D21X]  49.33 35.18 0 top
U13  CPG151101D13  [KEY-TH_CPG151101D21X]  12.13 16.58 0 top
U14  CPG151101D13  [KEY-TH_CPG151101D21X]  30.73 16.58 0 top
U15  CPG151101D13  [KEY-TH_CPG151101D21X]  49.33 16.58 0 top
USB1  TYPE-C 16PIN 2MD(073)  [USB-C-SMD_TYPE-C-16PIN-2MD-073]  38.48 78.49 0 bottom

## Footprints (pads in the part's own frame, mm; a bottom-side part is the same pattern mirrored in y, then rotated)
C0603
  rect 0.8x0.9 smd: 1(-0.7,0) 2(0.7,0)
CONN-SMD_2P-P1.25_XUNPU_WAFER-MX1.25-2PWB
  rect 0.7x1.7 smd: 1(-0.625,1.25) 2(0.625,1.25)
  rect 1.8x2.5 smd: 3(3.075,-1.25) 4(-3.075,-1.25)
ESOP-8_L4.9-W3.9-P1.27-LS6.0-BL-EP
  rect 0.6x1.2 smd: 1(-1.905,-2.909) 2(-0.635,-2.909) 3(0.635,-2.909) 4(1.905,-2.909) 5(1.905,2.909) 6(0.635,2.909) 7(-0.635,2.909) 8(-1.905,2.909)
  rect 3.3x2.4 smd: 9(0,0)
HDR-TH_6P-P2.54-V-M
  rect 1.7x1.7 hole 1.1: 1(-6.35,0)
  round 1.7 hole 1.1: 2(-3.81,0) 3(-1.27,0) 4(1.27,0) 5(3.81,0) 6(6.35,0)
KEY-TH_CPG151101D21X
  round 2.4 hole 1.6: 1(-3.175,-1.27) 2(3.175,1.27)
LCD-SMD_N069-9616TSWPG02-H14
  rect 2.5x0.4 smd: 1(0,-4.03) 2(0,-3.41) 3(0,-2.79) 4(0,-2.17) 5(0,-1.55) 6(0,-0.93) 7(0,-0.31) 8(0,0.31) 9(0,0.93) 10(0,1.55) 11(0,2.17) 12(0,2.79) 13(0,3.41) 14(0,4.03)
LED-SMD_4P-L2.0-W2.0-TL_WS2812B-2020
  rect 0.9x0.7 smd: 1(-0.915,0.55) 2(-0.915,-0.55) 3(0.915,-0.55) 4(0.915,0.55)
LED_0603
  rect 0.8x0.8 smd: 1(-0.851,-0.01) 2(0.75,-0.005)
Pad_e313
  round 4 hole 2.6: 1(0,0)
Pad_e314
  round 4 hole 2.6: 1(0,0)
Pad_e315
  round 4 hole 2.6: 1(0,0)
Pad_e316
  round 4 hole 2.6: 1(0,0)
R0603
  rect 0.806x0.864 smd: 1(-0.753,0) 2(0.753,0)
SOD-123FL_L2.8-W1.8-LS3.7-RD
  rect 1.2x1.2 smd: 1(-1.6,0) 2(1.6,0)
SOT-23-5_L3.0-W1.7-P0.95-LS2.8-BR
  rect 1.1x0.6 smd: 1(1.3,-0.95) 2(1.3,0) 3(1.3,0.95) 4(-1.3,0.95) 5(-1.3,-0.95)
SOT-23_L2.9-W1.3-P1.90-LS2.4-BR
  rect 1x0.8 smd: 1(1.15,-0.95) 2(1.15,0.95) 3(-1.15,0)
SW-SMD_L6.1-W3.5-LS8.0
  rect 1.25x1 smd: 1(-3.875,0) 2(3.875,0)
SW-TH_EC11XXXXXXXX
  oval 2.3x4 hole 1.5x3: 6(5.5,0.25) 7(-5.5,0.25)
  round 1.8 hole 1.3: A(-2.54,-7.25) B(2.54,-7.25) C(0,-7.25) D(-2.54,7.25) E(2.54,7.25)
SW-TH_MSK12C02
  rect 0.6x1.524 smd: 1(-2.25,1.7) 2(0.75,1.7) 3(2.25,1.7)
  rect 1.2x0.7 smd: 4(-3.6,-1.7) 4(-3.6,0.6) 4(3.6,-1.7) 4(3.6,0.6)
USB-C-SMD_TYPE-C-16PIN-2MD-073
  oval 1.2x1.8 hole 0.6x1.2: 13(-4.325,-2.375) 14(4.325,-2.375)
  oval 1.1x2 hole 0.6x1.5: 13(-4.325,1.825) 14(4.325,1.825)
  rect 0.55x1.1 smd: A1B12(-3.2,2.375) A4B9(-2.4,2.375) B1A12(3.2,2.375) B4A9(2.4,2.375)
  rect 0.3x1.1 smd: A5(-1.25,2.375) A6(-0.25,2.375) A7(0.25,2.375) A8(1.25,2.375) B5(1.75,2.375) B6(0.75,2.375) B7(-0.75,2.375) B8(-1.75,2.375)
WIRELM-SMD_ESP32-S3-WROOM-1
  rect 1.5x0.9 smd: 1(-8.75,8.895) 2(-8.75,7.625) 3(-8.75,6.355) 4(-8.75,5.085) 5(-8.75,3.815) 6(-8.75,2.545) 7(-8.75,1.275) 8(-8.75,0.005) 9(-8.75,-1.265) 10(-8.75,-2.535) 11(-8.75,-3.805) 12(-8.75,-5.075) 13(-8.75,-6.345) 14(-8.75,-7.615) 27(8.75,-7.615) 28(8.75,-6.345) 29(8.75,-5.075) 30(8.75,-3.805) 31(8.75,-2.535) 32(8.75,-1.265) 33(8.75,0.005) 34(8.75,1.275) 35(8.75,2.545) 36(8.75,3.815) 37(8.75,5.085) 38(8.75,6.355) 39(8.75,7.625) 40(8.75,8.895)
  rect 0.9x1.5 smd: 15(-6.985,-8.895) 16(-5.715,-8.895) 17(-4.445,-8.895) 18(-3.175,-8.895) 19(-1.905,-8.895) 20(-0.635,-8.895) 21(0.635,-8.895) 22(1.905,-8.895) 23(3.175,-8.895) 24(4.445,-8.895) 25(5.715,-8.895) 26(6.985,-8.865)
  rect 0.9x0.9 smd: 41(-2.9,-0.225) 41(-2.9,1.175) 41(-2.9,2.575) 41(-1.5,-0.225) 41(-1.5,1.175) 41(-1.5,2.575) 41(-0.1,-0.225) 41(-0.1,1.175) 41(-0.1,2.575)

## Nets
As in the schematic, except:
GND: C3.1 C4.1 C5.2 C6.2 C7.1 C8.1 C9.1 C10.2 C11.1 C12.2 C13.2 C14.2 C15.2 C16.2 C17.2 C18.2 C19.2 C20.2 C21.2 C22.1 C23.1 H1.6 LED3.2 LED4.2 LED5.2 LED6.2 LED7.2 LED8.2 LED9.2 LED10.2 LED11.2 NOREF.1 NOREF#2.1 NOREF#3.1 NOREF#4.1 R3.1 R6.2 R7.2 R8.1 R9.1 R10.1 R11.2 R26.2 SW1.1 SW2.1 SW3.6 SW3.7 SW3.C SW4.4 U1.2 U2.1 U2.40 U2.41 U3.7 U5.1 U5.3 U5.9 U6.2 U6.3 U6.4 U7.2 U8.2 U9.2 U10.2 U11.2 U12.2 U13.2 U14.2 U15.2 USB1.13 USB1.14 USB1.A1B12 USB1.B1A12

Pads without a net: LED11 1; SW4 3; U1 4; U2 11 12 21 25 26 28 29 30 31 32 38 39; U3 5 6; USB1 A8 B8

## Via types
v1: diameter 0.61, hole 0.305, Top Layer to Bottom Layer, 46 vias

## Routing (per net, layer and track width the routed paths; a pad name or vN(x,y) marks a point on that pad's centre or on a via; arc(x,y) is an arc through that point)
3V3: length 116.8
  Top Layer w0.254: SW3.D 49.95,77.06 v1(49.95,68.45) ; R5.2 30.1,72.01 ; v1(47.12,68.33) 47.12,64.63 ; 47.12,64.63 47.89,65.41 54.48,65.41 55.75,64.14 R25.1 ; 47.12,64.63 R24.1 ; R22.1 24.5,59.56 R4.2
  Top Layer w0.508: v1(6.96,68.76) 10.62,68.76 H1.1 16.89,62.23 R14.1 16.9,59.56 28.96,59.56 30.1,60.71 30.1,72.01 31.11,73.03 v1(33.27,73.03) 41.15,73.03 v1(42.42,74.3)
  Bottom Layer w0.508: 48.13,73.41 48.19,73.47 U1.5 50.39,74.97 C10.1 ; 48.13,73.41 48.13,70.27 v1(49.95,68.45) 49.82,68.33 v1(47.12,68.33) ; 48.13,73.41 47.24,74.3 v1(42.42,74.3) ; v1(33.27,73.03) 32.45,73.85 32.45,74.42 32.31,74.55 U2.2 ; U3.8 4.96,69.41 C8.2 ; R1.1 9.4,68.95 R2.1 8.31,68.76 v1(6.96,68.76) 5.93,68.76 5.2,69.49
+5V: length 54.6
  Top Layer w0.254: v1(32.64,61.2) 32.12,61.2 25.65,54.74 24.51,54.74 v1(21.97,52.2)
  Bottom Layer w0.254: v1(32.64,61.2) LED2.2 LED1.2 36.3,61.2 U5.8 36.08,62.48 36.08,71.11 ; R27.1 v1(21.97,52.2)
  Bottom Layer w0.508: 40.64,67.82 41.78,66.67 D1.2 42.68,66.46 R10.2 42.68,63.07 Q1.1 ; 40.64,67.82 40.64,70.74 ; 40.64,67.82 U5.4 ; USB1.B4A9 40.89,76.1 40.89,70.99 40.64,70.74 ; 40.64,70.74 40.39,70.48 36.7,70.48 36.08,71.11 USB1.A4B9
GND: length 61.9
  Bottom Layer w0.254: H1.6 16.25,75.82 U2.40 ; U9.2 51.18,53.72 C16.2 ; C13.2 51.37,35.31 U12.2 ; C12.2 14.62,54.36 U7.2 ; U13.2 14.61,17.15 C15.2 ; C19.2 52.31,17.65 U15.2 ; U5.1 36.83,66.04 38.23,64.64 U5.9 39.37,65.28 U5.3 39.37,69.08 R11.2 ; C17.2 33.46,17.4 U14.2 ; U2.41 U2.41 ; U2.41 U2.41 ; U2.41 U2.41 ; U2.41 U2.41 ; U2.41 U2.41 ; U2.41 U2.41 ; U2.41 U2.41 ; U2.41 U2.41 ; R7.2 38.38,71.74 38.38,71.53 ; C18.2 14.42,35.56 U10.2 ; U11.2 33.15,35.69 C20.2 ; C8.1 6.67,70.29 6.35,70.61 4.7,70.61 4.12,70.03 U3.7 ; v1(38.38,71.34) 38.38,71.53 ; 38.38,71.53 R6.2
  Bottom Layer w0.508: 35.31,74.8 35.31,76.09 USB1.A1B12 ; USB1.B1A12 41.68,74.8
  vias: v1(8.38,72.77) v1(8.38,70.98) v1(10.67,44.58) v1(11.05,26.29) v1(19.56,74.93) v1(22.06,74.93) v1(24.77,74.93) v1(27.94,70.87) v1(27.94,66.99) v1(28.32,62.23) v1(37.59,65.41) v1(38.53,64.64) v1(39.24,63.88) v1(42.29,60.58) v1(42.93,71.88) v1(43.69,68.58) v1(44.07,58.93) v1(45.21,56.77)
VBAT: length 11.5
  Bottom Layer w0.508: 40.76,54.72 40.64,54.83 U5.5 43.25,61.73 Q1.2
VCC: length 232.4
  Top Layer w0.508: 14.59,46.61 31.56,46.61 LED8.4 32.45,45.72 v1(35.81,45.72) ; 14.59,46.61 10.41,46.61 9.65,45.85 9.65,43.81 10.92,42.55 10.92,36.97 15.42,32.47 15.42,29.41 13.74,27.73 LED10.4 13.61,27.09 12.64,28.07 10.8,28.07 10.29,27.56 10.29,25.4 11.68,24 11.68,17.78 16,13.46 16,10.68 13.74,8.42 LED11.4 ; 14.59,46.61 LED9.4 ; LED4.4 52.62,27.22 54.48,29.08 v1(54.48,29.06) ; v1(36.83,10.12) 35.01,8.3 LED6.4 ; v1(54.48,12.08) 51.08,8.68 LED5.4 ; LED7.4 34.84,27.09 v1(36.83,29.09) ; v1(53.21,47.75) 51.22,45.76 LED3.4
  Bottom Layer w0.254: U1.3 53.66,71.57 54.23,72.14 54.23,73.03 53.79,73.47 U1.1
  Bottom Layer w0.508: U1.3 52.99,69.61 SW4.1 59.87,62.73 59.87,59.81 60.83,58.84 60.83,55.37 v1(53.21,47.75) 53.21,39.12 54.48,37.85 v1(54.48,29.06) v1(54.48,12.08) 54.48,7.24 52.7,5.46 38.48,5.46 36.83,7.11 v1(36.83,10.12) v1(36.83,29.09) 36.83,44.7 v1(35.81,45.72)
A: length 24.6
  Top Layer w0.254: C23.2 SW3.A 47.39,62.62 R24.2 39.75,69.47 v1(32.13,69.47)
  Bottom Layer w0.254: U2.6 v1(32.13,69.47)
B: length 38.3
  Top Layer w0.254: C22.2 SW3.B 54.5,63.87 R25.2 57.4,64.27 57.4,65.28 55.5,67.18 49.28,67.18 47.37,69.09 44.45,69.09 42.79,70.74 v1(32.13,70.74)
  Bottom Layer w0.254: U2.5 v1(32.13,70.74)
D+: length 36.2
  Bottom Layer w0.254: U2.14 29.08,59.31 28.65,59.75 28.23,59.75 26.26,61.71 26.26,75.99 27.52,77.24 30.69,77.24 31.96,78.51 37.06,78.51 38.18,77.38 38.18,76.96 38.23,76.92 USB1.A6 38.25,76.13 38.25,76.21 38.3,76.26 38.3,76.78 38.47,76.94 39,76.94 39.16,76.78 39.16,76.18 USB1.B6
D-: length 36.2
  Bottom Layer w0.254: U2.13 29.08,60.58 28.65,60.15 28.4,60.15 27.68,60.87 arc(27.63,60.99) 27.68,61.11 arc(27.73,61.23) 27.68,61.35 27.56,61.47 arc(27.44,61.52) 27.32,61.47 arc(27.2,61.42) 27.08,61.47 26.67,61.88 26.67,62.41 arc(26.73,62.54) 26.86,62.6 arc(27,62.65) 27.05,62.79 27.05,62.91 arc(27,63.05) 26.86,63.1 arc(26.73,63.16) 26.67,63.29 26.67,75.82 27.01,76.16 arc(27.1,76.19) 27.19,76.16 arc(27.28,76.12) 27.37,76.16 27.55,76.34 arc(27.58,76.42) 27.55,76.51 arc(27.51,76.6) 27.55,76.69 27.69,76.84 30.86,76.84 32.13,78.11 32.59,78.11 arc(32.77,78.03) 32.84,77.86 arc(32.92,77.68) 33.09,77.61 33.1,77.61 arc(33.28,77.68) 33.35,77.86 arc(33.42,78.03) 33.6,78.11 35.94,78.11 arc(36.04,78.06) 36.09,77.96 arc(36.13,77.85) 36.24,77.81 36.45,77.81 arc(36.55,77.85) 36.59,77.96 arc(36.64,78.06) 36.74,78.11 36.89,78.11 37.78,77.22 37.78,76.96 37.73,76.92 USB1.B7 37.8,76.04 37.8,75.45 37.97,75.28 38.5,75.28 38.66,75.45 38.66,76.04 USB1.A7
E: length 31.6
  Top Layer w0.254: C21.1 53.91,78.56 SW3.E 52.96,79.13 R26.1 50.41,79.13 49.28,80.26 46.99,80.26 44.2,77.47 44.2,75.06 41.15,72.01 v1(32.13,72.01)
  Bottom Layer w0.254: U2.4 v1(32.13,72.01)
IO0: length 20.2
  Top Layer w0.254: R5.1 21.66,70.55 C6.1 19.68,69.28 SW2.2 18.73,67.44 H1.3
  Bottom Layer w0.254: H1.3 14.61,65.02 14.61,60.33 13.59,59.31 U2.27
OLED_RST: length 24.1
  Bottom Layer w0.254: U2.35 12.58,69.47 11.68,69.47 11.18,69.98 11.18,73.03 8.76,75.44 1.4,75.44 0.51,74.55 0.51,69.09 0.8,68.79 U3.9
RGB: length 45.1
  Top Layer w0.254: LED3.3 51.17,44.66 56.52,50 56.52,55.88 55.24,57.15 49.28,57.15 38.22,68.2 v1(32.13,68.2)
  Bottom Layer w0.254: U2.7 v1(32.13,68.2)
RST: length 39.3
  Top Layer w0.254: v1(28.19,73.28) 24.64,76.84 14.86,76.84 13.97,75.95 13.97,67.44 16.51,64.9 H1.2 18.98,64.9 ; 18.98,64.9 19.24,64.9 SW1.2 23,61.14 R4.1 ; 18.98,64.9 C5.1
  Bottom Layer w0.254: U2.3 30.08,73.28 v1(28.19,73.28)
RX: length 4.7
  Bottom Layer w0.254: U2.36 14.73,70.74 15.49,69.98 H1.4
SCL: length 10.4
  Bottom Layer w0.254: U3.10 10.13,68.17 R1.2 10.42,68.2 U2.34
SDA: length 10.6
  Bottom Layer w0.254: U2.33 9.02,66.93 R2.2 8.4,67.55 U3.11
SW1: length 17.8
  Top Layer w0.254: R14.2 v1(16.89,56.3)
  Bottom Layer w0.254: 9.46,52.58 16.13,52.58 16.89,53.34 v1(16.89,56.3) U2.24 ; 9.46,52.58 9.39,52.51 U7.1 9.03,52.58 9.46,52.58 ; 9.46,52.58 C12.1
SW2: length 10.6
  Top Layer w0.254: 25.78,58.17 v1(25.78,56.34)
  Bottom Layer w0.254: C14.1 27.56,50.23 U8.1 25.78,54.29 v1(25.78,56.34) U2.17
SW3: length 29.9
  Top Layer w0.254: U9.1 46.16,58.36 37.59,66.93 v1(33.15,66.93) 33.14,66.93 R18.2
  Bottom Layer w0.254: 48.7,53.72 47.49,52.51 U9.1 ; U2.8 v1(33.15,66.93)
SW4: length 36
  Top Layer w0.254: R20.2 v1(18.16,56.28)
  Bottom Layer w0.254: U2.23 v1(18.16,56.28) 18.16,36.32 15.75,33.91 U10.1 ; 9.46,33.91 C18.1
SW5: length 30
  Top Layer w0.254: R22.2 v1(24.51,56.36)
  Bottom Layer w0.254: C20.1 28,33.91 U11.1 24.51,36.96 v1(24.51,56.36) 24.51,58.03
SW6: length 46.1
  Top Layer w0.254: U12.1 44.2,35.87 44.2,57.15 35.68,65.66 v1(33.15,65.66) 33.14,65.66 R15.2
  Bottom Layer w0.254: C13.1 47.18,33.91 U12.1 ; U2.9 v1(33.15,65.66)
SW7: length 56.5
  Top Layer w0.254: R17.2 v1(19.43,56.34)
  Bottom Layer w0.254: 9.71,15.37 9.02,15.37 U13.1 9.66,15.31 9.71,15.37 ; 9.71,15.37 C15.1 ; 9.71,15.37 16.64,15.37 19.43,18.16 v1(19.43,56.34) U2.22
SW8: length 49.1
  Top Layer w0.254: R19.2 v1(23.24,56.34)
  Bottom Layer w0.254: U2.19 v1(23.24,56.34) 23.24,19.63 U14.1 29.53,17.28 C17.1
SW9: length 62.7
  Top Layer w0.254: R21.2 33.14,64.39 v1(33.15,64.39) 34.28,64.39 42.42,56.26 42.42,19.05 U15.1
  Bottom Layer w0.254: C19.1 47.94,17.09 U15.1 ; U2.10 v1(33.15,64.39)
TX: length 4.6
  Bottom Layer w0.254: H1.5 15.37,72.52 14.86,72.01 U2.37
$1N2133: length 3.1
  Bottom Layer w0.254: U3.1 4.98,73.75 C1.2
$1N2137: length 4.8
  Bottom Layer w0.254: U3.2 5.76,73.13 C1.1
$1N2143: length 4.7
  Bottom Layer w0.254: U3.3 5.91,72.51 C2.2
$1N2148: length 3
  Bottom Layer w0.254: U3.4 5.13,71.89 C2.1
$1N2568: length 7.6
  Bottom Layer w0.254: R3.2 7.35,66.93 U3.12
$1N2573: length 5.5
  Bottom Layer w0.254: U3.13 6.02,66.31 C4.2
$1N2579: length 3.3
  Bottom Layer w0.254: U3.14 4.73,65.69 C3.2
$1N3771: length 2.6
  Bottom Layer w0.254: R6.1 40.23,74.89 USB1.B5
$1N3797: length 2.4
  Bottom Layer w0.254: R7.1 37.23,74.39 USB1.A5
$1N5918: length 1.8
  Bottom Layer w0.254: U5.2 38.1,68.84 R11.1
$1N6180: length 6.8
  Bottom Layer w0.254: R12.1 39.08,58.43 38.39,57.75 35.75,57.75 33.9,59.6
$1N6206: length 2.7
  Bottom Layer w0.254: R13.1 36.85,58.43 LED1.1
$1N6234: length 1.9
  Bottom Layer w0.254: U5.6 39.37,60.19 R12.2
$1N6239: length 1.9
  Bottom Layer w0.254: U5.7 38.1,60.19 R13.2
$1N7983: length 2.9
  Bottom Layer w0.254: U2.20 R27.2
$1N8046: length 21.5
  Bottom Layer w0.508: D1.1 45.72,66.62 45.72,61.72 44.97,60.97 ; Q1.3 44.7,60.7 44.97,60.97 ; 44.97,60.97 44.97,60.77 58.43,60.77 SW4.2
$1N8051: length 2
  Bottom Layer w0.254: R9.2 28.32,56.78 U2.15
$1N8053: length 4.2
  Bottom Layer w0.254: R8.2 27.05,56.4 U2.16
$2N1506: length 27.7
  Top Layer w0.254: LED3.1 49.74,45.76 50.17,45.34 50.17,44.2 56.9,37.47 56.9,28.19 54.82,26.12 LED4.3
$2N1512: length 24.9
  Top Layer w0.254: LED5.3 51.17,7.2 55.75,11.78 55.75,18.67 50.17,24.26 50.17,26.67 49.61,27.22 LED4.1
$2N1519: length 17.5
  Top Layer w0.254: LED6.3 32.62,6.99 44.45,6.99 45.76,8.3 LED5.1
$2N1526: length 19.8
  Top Layer w0.254: LED7.3 32.41,16.48 34.04,14.86 34.04,11.75 LED6.1
$2N1533: length 20
  Top Layer w0.254: LED7.1 30.9,27.09 34.04,30.23 34.04,33.02 32.26,34.8 32.26,44.51 LED8.3
$2N1540: length 17.4
  Top Layer w0.254: LED9.3 13.83,44.58 22.73,44.58 23.88,45.72 30.54,45.72 LED8.1
$2N1547: length 23.1
  Top Layer w0.254: LED9.1 12.15,45.76 12.83,45.09 12.83,36.45 16.64,32.64 16.64,28.79 13.84,25.99 LED10.3
$2N1562: length 24
  Top Layer w0.254: LED11.3 14.44,7.2 17.14,9.91 17.14,13.84 12.83,18.16 12.83,26.42 12.15,27.09 LED10.1

## Copper pours and planes (outline as drawn; the poured copper is in the pictures)
GND on Top Layer: -5.21,92.71 73.15,92.71 73.15,-5.33 -5.21,-5.33
GND on Bottom Layer: -21.84,103.12 81.79,103.12 81.79,-11.18 -21.84,-11.18

Small or netless copper shapes (teardrops, artwork), in the pictures only: 128 on Top Layer, 233 on Bottom Layer

## Text on the board
Top Silkscreen Layer: 3V3 | RXD | RST | GND | TXD | IO0
